# EAGLE design RP2040-mini_4L (EAGLE 9.5.2)
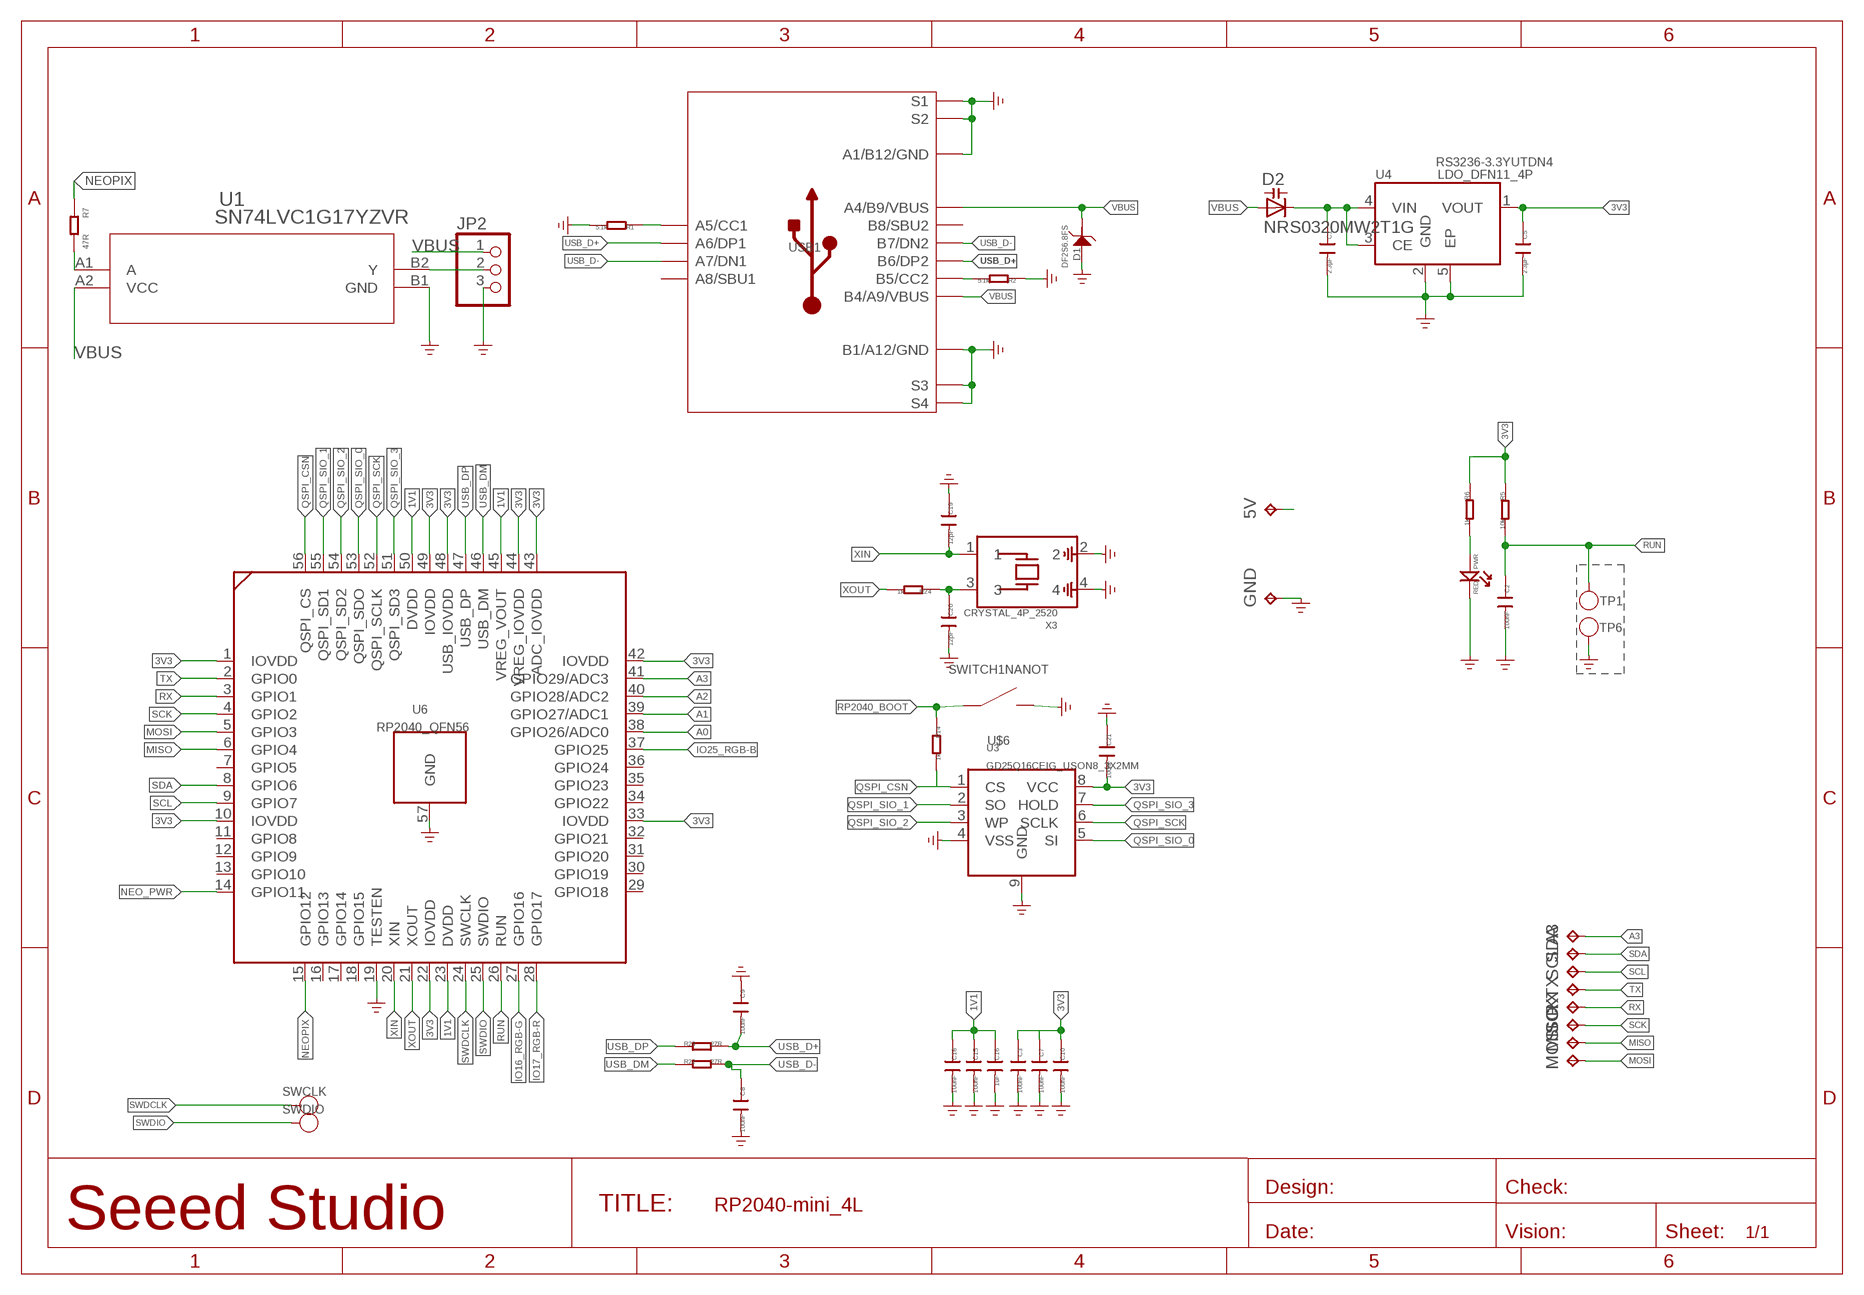
[diagram p0: schematic, sheet 1]

## Parts
5V  TPTP09R  [TP09R]
A3  TPTP07R  [TP07R]
C1  2.3µF  CAP\0201NNS  [0201_NORMAL\NOSILK]
C2  100nF  CAP\0201NNS  [0201_NORMAL\NOSILK]
C3  100nF  CAP\0201NNS  [0201_NORMAL\NOSILK]
C5  2.3µF  CAP\0201NNS  [0201_NORMAL\NOSILK]
C7  100nF  CAP\0201NNS  [0201_NORMAL\NOSILK]
C8  100nF  CAP\0201NNS  [0201_NORMAL\NOSILK]
C9  100nF  CAP\0201NNS  [0201_NORMAL\NOSILK]
C10  100nF  CAP\0201NNS  [0201_NORMAL\NOSILK]
C15  100nF  CAP\0201NNS  [0201_NORMAL\NOSILK]
C16  1uF  CAP\0201NNS  [0201_NORMAL\NOSILK]
C18  100nF  CAP\0201NNS  [0201_NORMAL\NOSILK]
C19  12pF  CAP\0201NNS  [0201_NORMAL\NOSILK]
C20  12pF  CAP\0201NNS  [0201_NORMAL\NOSILK]
C21  100nF  CAP\0201NNS  [0201_NORMAL\NOSILK]
D1  DF2S6.8FS  D-ESD-2P'DF2S6.8FS'  [SOD-923]
D2  NRS0320MW2T1G  DIODE_CAPACITANCE-SOD523  [SOD523]
GND  TPTP09R  [TP09R]
JP2  PINHD-1X3  [1X03]
MISO  TPTP07R  [TP07R]
MOSI  TPTP07R  [TP07R]
PWR  RED  LED-0402  [LED-0402]
R1  5.1k  R-0201  [R0201]
R2  5.1k  R-0201  [R0201]
R5  10k  R-0201  [R0201]
R6  1k  R-0201  [R0201]
R7  47R  RES-0201  [R0201]
R14  1k  R-0201  [R0201]
R22  27R  R-0201  [R0201]
R23  27R  R-0201  [R0201]
R24  1k  R-0201  [R0201]
RX  TPTP07R  [TP07R]
SCK  TPTP07R  [TP07R]
SCL  TPTP07R  [TP07R]
SDA  TPTP07R  [TP07R]
SWCLK  TEST-POINT-35  [TP_3535]
SWDIO  TEST-POINT-35  [TP_3535]
TP1  TEST-POINT-35  [TP_3535]
TP6  TEST-POINT-35  [TP_3535]
TX  TPTP07R  [TP07R]
U1  SN74LVC1G17YZVR  [YZV4]
U3  GD25Q16CEIG_USON8_3X2MM  [GD25Q16CEIG_USON8_3X2MM]
U4  LDO_DFN11_4P  [LDO_DFN1*1_4P]
U6  RP2040_QFN56  [RP2040_QFN56]
U$6  SWITCH1NANOT  [NANOT]
USB1  USB2.0-TYPE-C  [USB2.0-TYPE-C]
X3  CRYSTAL_4P_2520  [CRYSTAL_4P_2520]

## Nets
1V1: C15.1 C16.1 C18.1 U6.23(DVDD) U6.45(VREG_VOUT) U6.50(DVDD)
3V3: C3.1 C5.1 C7.1 C10.1 C21.2 R5.1 R6.1 U3.8(VCC) U4.1(VOUT) U6.1(IOVDD) U6.10(IOVDD) U6.22(IOVDD) U6.33(IOVDD) U6.42(IOVDD) U6.43(ADC_IOVDD) U6.44(VREG_IOVDD) U6.48(USB_IOVDD) U6.49(IOVDD)
A0: U6.38(GPIO26/ADC0)
A1: U6.39(GPIO27/ADC1)
A2: U6.40(GPIO28/ADC2)
A3: A3.TP U6.41(GPIO29/ADC3)
GND: C1.2 C2.2 C3.2 C5.2 C7.2 C8.2 C9.1 C10.2 C15.2 C16.2 C18.2 C19.1 C20.2 C21.1 D1.2 GND.TP JP2.3 PWR.- R1.2 R2.1 TP6.T U1.B1(GND) U3.4(VSS) U3.9(GND) U4.2(GND) U4.5(EP) U6.19(TESTEN) U6.57(GND) U$6.2(B) USB1.A1_B12(A1/B12/GND) USB1.B1_A12(B1/A12/GND) USB1.S1 USB1.S2 USB1.S3 USB1.S4 USB1.S5(S1) USB1.S6(S2) X3.2 X3.4 ; supply symbol labelled GND_POWER
IO16_RGB-G: U6.27(GPIO16)
IO17_RGB-R: U6.28(GPIO17)
IO25_RGB-B: U6.37(GPIO25)
MISO: MISO.TP U6.6(GPIO4)
MOSI: MOSI.TP U6.5(GPIO3)
N$1: R1.1 USB1.A5(A5/CC1)
N$2: R2.2 USB1.B5(B5/CC2)
N$4: JP2.2 U1.B2(Y)
N$7: R7.1 U1.A1(A)
N$8: C20.1 R24.1 X3.3
N$16: PWR.+ R6.2
NEO_PWR: U6.14(GPIO11)
NEOPIX: R7.2 U6.15(GPIO12)
QSPI_CSN: R14.2 U3.1(CS) U6.56(QSPI_CS)
QSPI_SCK: U3.6(SCLK) U6.52(QSPI_SCLK)
QSPI_SIO_0: U3.5(SI) U6.53(QSPI_SDO)
QSPI_SIO_1: U3.2(SO) U6.55(QSPI_SD1)
QSPI_SIO_2: U3.3(WP) U6.54(QSPI_SD2)
QSPI_SIO_3: U3.7(HOLD) U6.51(QSPI_SD3)
RP2040_BOOT: R14.1 U$6.1(A)
RUN: C2.1 R5.2 TP1.T U6.26(RUN)
RX: RX.TP U6.3(GPIO1)
SCK: SCK.TP U6.4(GPIO2)
SCL: SCL.TP U6.9(GPIO7)
SDA: SDA.TP U6.8(GPIO6)
SWDCLK: SWCLK.T U6.24(SWCLK)
SWDIO: SWDIO.T U6.25(SWDIO)
TX: TX.TP U6.2(GPIO0)
USB_D+: C9.2 R23.2 USB1.A6(A6/DP1) USB1.B6(B6/DP2)
USB_D-: C8.1 R22.2 USB1.A7(A7/DN1) USB1.B7(B7/DN2)
USB_DM: R22.1 U6.46(USB_DM)
USB_DP: R23.1 U6.47(USB_DP)
VBUS: 5V.TP D1.1 D2.A JP2.1 U1.A2(VCC) USB1.A4_B9(A4/B9/VBUS) USB1.B4_A9(B4/A9/VBUS)
VIN: C1.1 D2.C U4.3(CE) U4.4(VIN)
XIN: C19.2 U6.20(XIN) X3.1
XOUT: R24.2 U6.21(XOUT)
Unconnected: U6.7(GPIO5) U6.11(GPIO8) U6.12(GPIO9) U6.13(GPIO10) U6.16(GPIO13) U6.17(GPIO14) U6.18(GPIO15) U6.29(GPIO18) U6.30(GPIO19) U6.31(GPIO20) U6.32(GPIO21) U6.34(GPIO22) U6.35(GPIO23) U6.36(GPIO24) USB1.A8(A8/SBU1) USB1.B8(B8/SBU2)

## Notes on the sheet
- RS3236-3.3YUTDN4

## Library data of the parts
5V A3 GND MISO MOSI RX SCK SCL SDA TX = testpad:TP: Test pad
C1-C3 C5 C7-C10 C15 C16 C18-C21 = Seeed-Discrete:CAP: Ceramic Capacitors
D1 = Discrete-new:D-ESD-2P: SOD-923:304060009;SOD-123:304060001
D2 = XIAO RP2040 PRD v1.0:DIODE_CAPACITANCE-: Capacity DIODE
JP2 = Connector:PINHD-1X3: PIN HEADER; CATEGORY: CONNECTOR; SUB-CATEGORY: PIN-HEADER
PWR = Discrete-small:LED
R1 R2 R5 R6 R14 R22-R24 = XIAO RP2040 PRD v1.0:R*
R7 = Discrete-new:RES
SWCLK SWDIO TP1 TP6 = Discrete-new:TEST-POINT
U1 = thar:SN74LVC1G17YZVR; COPYRIGHT: Copyright (C) 2024 Ultra Librarian. All rights reserved.; MANUFACTURER_PART_NUMBER: SN74LVC1G17YZVR; MFR_NAME: Texas Instruments
U3 = FLASH_GD25Q16CEIG_2:GD25Q16CEIG_USON8_3X2MM
U4 = LDO_DFN1X1_4P:LDO_DFN1*1_4P
U6 = RP2040_QFN56:RP2040_QFN56
U$6 = thar:SWITCH1: OMRON ELECTRONIC COMPONENTS - A6S1104H - SCHALTER,DIP,GEHOBENER BETAETIGER,1POL Farnell Best.Nr.: 1960892 Herst.Bez.: A6S1104H
USB1 = USB C:USB2.0-TYPE-C
X3 = CRYSTAL_4P:CRYSTAL_4P_2520

## Net classes
0 default: width 0.089 mm, drill 0.2 mm, clearance 0.102 mm
1 power: width 0.152 mm, drill 0.152 mm, clearance 0.152 mm
2 gnd: width 0.152 mm, drill 0.152 mm, clearance 0.152 mm
3 usbvcc: width 0.152 mm, drill 0.152 mm, clearance 0.152 mm

## Board
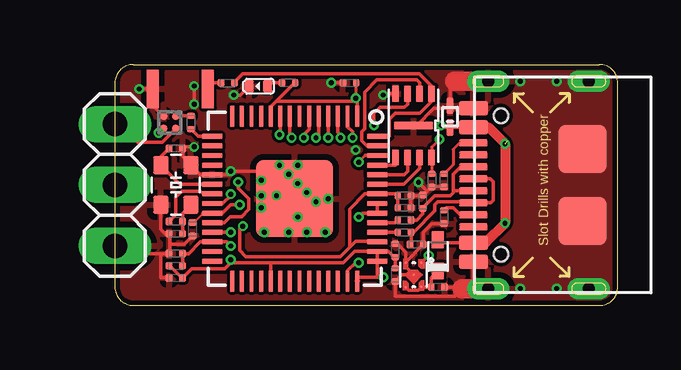
[diagram p1: board, top side]
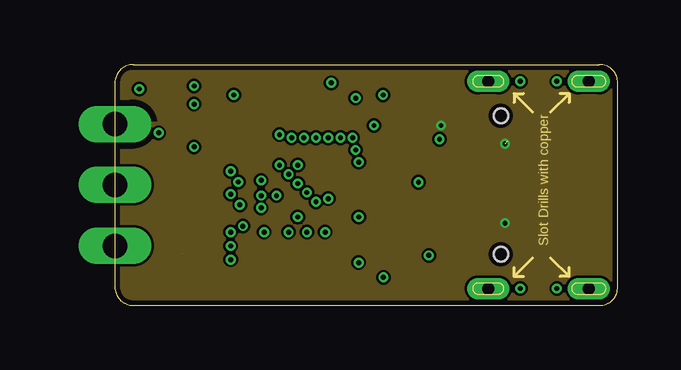
[diagram p2: board, inner layer Route2]
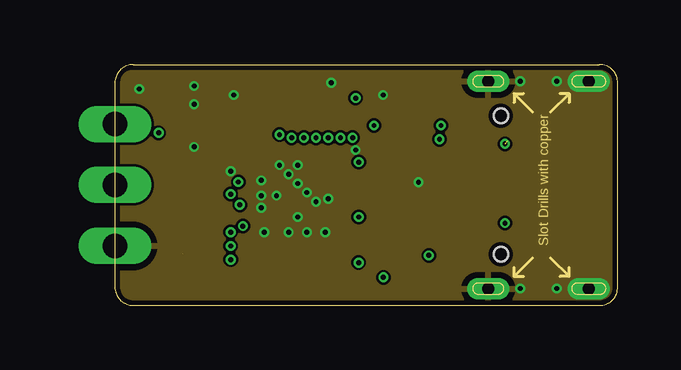
[diagram p3: board, inner layer Route15]
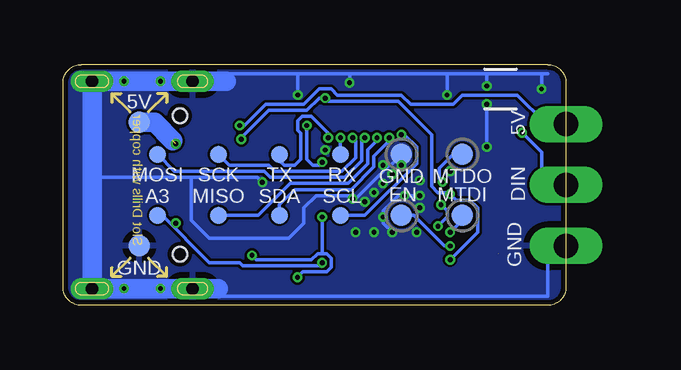
[diagram p4: board, bottom side, seen from below]

Size 20.95 x 10.03 mm. Coordinates in mm from the lower left corner, seen from the top.
Outline: 20.95,0.76 20.95,9.27 arc90 20.19,10.03 0.76,10.03 arc90 0,9.27 0,0.76 arc90 0.76,0 20.19,0 arc90 20.95,0.76
Copper layers (1*16): Top 0.035mm / dielectric 0.2mm / Bottom 0.035mm
Design rules "Seeed": minimum track width 1mil, minimum drill 0.2mm, track to track 4mil, track to pad 4mil, pad to pad 4mil, via to via 4mil, smd to smd 0mil, copper to edge 0.2mm, drill to drill 12mil, minimum pad ring 4mil, minimum via ring 4mil, stop-mask expansion 4mil, vias tented up to drill 25mil, thermal gap 10mil

### Footprints (pad centres in the part's own frame; a part is rotated, then mirrored left to right if it is on the bottom)
TP09R = smd 0.9 x 0.9: TP 0,0
TP07R = smd 0.7 x 0.7: TP 0,0
0201_NORMAL\NOSILK = smd 0.279 x 0.318: 1 -0.279,0; 2 0.279,0
SOD-923 = smd 0.7 x 0.3: 1 -0.45,0; 2 0.45,0
SOD523 = smd 0.7 x 0.5: A 0.7,0; C -0.6,0
1X03 = drill 1.016 long: 1 -2.54,0; 2 0,0; 3 2.54,0
LED-0402 = smd 0.385 x 0.508: + -0.383,0; - 0.383,0
R0201 = smd 0.279 x 0.318: 1 -0.279,0; 2 0.279,0
TP_3535 = smd 0.889 x 0.889: T 0,0
YZV4 = smd 0.305 x 0.305: A1 -0.25,0.25; A2 0.25,0.25; B1 -0.25,-0.25; B2 0.25,-0.25
GD25Q16CEIG_USON8_3X2MM = smd 0.65 x 0.3: 1 -1.33,0.75; 2 -1.33,0.25; 3 -1.33,-0.25; 4 -1.33,-0.75; 5 1.33,-0.75; 6 1.33,-0.25; 7 1.33,0.25; 8 1.33,0.75 | smd 0.3 x 1.6: 9 0,0
LDO_DFN1*1_4P = smd 0.1 x 0.1: 1 -0.33,-0.5; 2 0.33,-0.5; 3 0.33,0.51; 4 -0.33,0.5; 5 0,0
RP2040_QFN56 = smd 0.875 x 0.2: 1 -3.438,2.6; 2 -3.438,2.2; 3 -3.438,1.8; 4 -3.438,1.4; 5 -3.438,1; 6 -3.438,0.6; 7 -3.438,0.2; 8 -3.438,-0.2; 9 -3.438,-0.6; 10 -3.438,-1; 11 -3.438,-1.4; 12 -3.438,-1.8; 13 -3.438,-2.2; 14 -3.438,-2.6; 29 3.438,-2.6; 30 3.438,-2.2; 31 3.438,-1.8; 32 3.438,-1.4; 33 3.438,-1; 34 3.438,-0.6; 35 3.438,-0.2; 36 3.438,0.2; 37 3.438,0.6; 38 3.438,1; 39 3.438,1.4; 40 3.438,1.8; 41 3.438,2.2; 42 3.438,2.6 | smd 0.2 x 0.875: 15 -2.6,-3.438; 16 -2.2,-3.438; 17 -1.8,-3.438; 18 -1.4,-3.438; 19 -1,-3.438; 20 -0.6,-3.438; 21 -0.2,-3.438; 22 0.2,-3.438; 23 0.6,-3.438; 24 1,-3.438; 25 1.4,-3.438; 26 1.8,-3.438; 27 2.2,-3.438; 28 2.6,-3.438; 43 2.6,3.438; 44 2.2,3.438; 45 1.8,3.438; 46 1.4,3.438; 47 1,3.438; 48 0.6,3.438; 49 0.2,3.438; 50 -0.2,3.438; 51 -0.6,3.438; 52 -1,3.438; 53 -1.4,3.438; 54 -1.8,3.438; 55 -2.2,3.438; 56 -2.6,3.438 | smd 3.2 x 3.2: 57 0,0
NANOT = smd 0.5 x 1.6: 1 -1.15,0; 2 1.15,0
USB2.0-TYPE-C = smd 1.2 x 0.6: A1_B12 0.05,3.2; A4_B9 0.05,2.4; B1_A12 0.05,-3.2; B4_A9 0.05,-2.4 | smd 1.2 x 0.3: A5 0.05,1.25; A6 0.05,0.25; A7 0.05,-0.25; A8 0.05,-1.25; B5 0.05,-1.75; B6 0.05,-0.75; B7 0.05,0.75; B8 0.05,1.75 | drill 0.508 pad 0.889 long: S1 -4.763,4.318; S2 -4.763,-4.318; S3 -0.572,4.318; S4 -0.572,-4.318 | smd 2 x 2: S5 -4.5,1.5; S6 -4.5,-1.5 | hole 0.6: -1.1,-2.89; -1.1,2.89
CRYSTAL_4P_2520 = smd 0.75 x 0.65: 1 -0.825,-0.625; 2 0.825,-0.625; 3 0.825,0.625; 4 -0.825,0.625

### Placement (x,y rotation side)
5V  17.78,7.62 0 bottom
A3  17.02,3.75 0 bottom
C1  13.46,0.76 0 top
C2  2.54,2.16 180 top
C3  9.78,9.27 180 top
C5  2.54,1.14 180 top
C7  11.68,2.29 90 top
C8  12.57,2.54 0 top
C9  12.83,4.32 270 top
C10  11.68,1.27 270 top
C15  3.24,3.18 270 top
C16  12.06,4.06 0 top
C18  12.06,4.57 0 top
C19  2.54,6.54 180 top
C20  2.54,2.98 180 top
C21  13.21,5.21 90 top
D1  13.97,7.86 90 top
D2  13.46,2.03 90 top
GND  17.78,2.48 0 bottom
JP2  0,5.02 270 top
MISO  14.48,3.75 90 bottom
MOSI  17.02,6.29 90 bottom
PWR  5.98,9.13 180 top
R1  13.72,3.68 270 top
R2  13.72,5.21 90 top
R5  2.54,1.65 0 top
R6  7.24,9.27 180 top
R7  3.18,7.62 270 top
R14  4.7,9.27 0 top
R22  12.06,3.05 0 top
R23  12.06,3.56 0 top
R24  2.54,3.49 180 top
RX  9.4,6.29 90 bottom
SCK  14.48,6.29 90 bottom
SCL  9.4,3.75 90 bottom
SDA  11.94,3.75 0 bottom
SWCLK  4.32,6.29 0 bottom
SWDIO  4.32,3.75 0 bottom
TP1  6.86,3.75 0 bottom
TP6  6.86,6.29 0 bottom
TX  11.94,6.29 90 bottom
U1  2.29,7.62 270 top
U3  12.45,7.49 270 top
U4  12.45,1.27 180 top
U6  7.49,4.45 270 top
U$6  2.73,9.02 180 top
USB1  14.99,5.02 180 top
X3  2.54,5.02 270 top

### Tracks (layer width: path | path; a pad name or v marks a point on that pad's centre or on a via)
1V1  (via drill 0.2)
  Top 0.102: C15.1 3.3,3.45 3.64,3.79 3.64,3.82 3.67,3.85
  Top 0.127: 11.79,4.65 C18.1
  Top 0.152: C18.1 C16.1 | 11.79,4.65 U6.50 10.41,4.65 9.78,4.01 9.78,2.41 | 9.78,2.41 10.03,2.67 10.91,2.67 U6.45 | 9.78,2.41 9.4,2.03 5.46,2.03 5.21,2.29 5.21,3.18 v5.33,3.3 | 3.67,3.85 U6.23 4.48,3.85 4.83,4.19 v5.21,4.19
  Bottom 0.152: v5.33,3.3 4.95,3.68 4.95,3.94 v5.21,4.19
3V3  (via drill 0.2, 0.2 pad 0.41)
  Top 0.127: v13.53,6.92 13.2,6.59 U3.8 13.21,6.15 C21.2 | C3.1 10.03,9.12 v10.03,8.64
  Top 0.152: U6.49 U6.48 10.32,3.85 v10.16,3.68 | U6.44 U6.43 10.93,1.17 v11.19,1.17 10.09,1.17 U6.42 | C10.1 11.68,1.95 | 11.68,1.95 C7.1 | U6.1 10.09,8.64 v10.03,8.64 10.03,8.51 6.73,8.51 | 6.48,1.78 6.49,1.76 U6.33 | U6.44 11.39,2.25 11.68,1.95 | R5.1 2.29,1.65 2.79,1.14 C5.1 2.99,1.31 3.2,1.52 4.57,1.52 4.83,1.78 | 6.48,1.78 4.83,1.78 | U6.22 4.5,4.24 4.83,4.57 v4.83,4.64 | 6.48,1.78 9.52,1.78 9.99,2.25 U6.44 | R6.1 7.49,9.27 6.73,8.51 | 6.73,8.51 6.49,8.27 U6.10 | U4.1 v13.08,2.08 | v4.83,1.91 4.83,1.78
  Top 0.203: U6.42 10.11,1.02
  Bottom 0.152: v4.83,1.91 3.68,3.05 3.68,4.06 4,4.38 4.57,4.38 v4.83,4.64 4.89,4.7 5.33,4.7 5.59,4.95 5.59,7.11 6.98,8.51 9.91,8.51 v10.03,8.64 10.29,8.64 10.79,8.13 12.38,8.13 13.53,6.99 v13.53,6.92 | v10.16,3.68 10.16,2.16 | 10.16,2.16 9.97,2.16 9.78,1.97 9.78,1.59 9.97,1.4 10.96,1.4 v11.19,1.17 | v13.08,2.08 12.9,1.91 10.6,1.91 10.35,2.16 10.16,2.16
A3  (via drill 0.2)
  Top 0.152: U6.41 9.69,1.44 10.03,1.78 v10.16,1.78
  Bottom 0.152: A3.TP 16.83,3.75 14.86,1.78 13.59,1.78 13.46,1.65 10.29,1.65 v10.16,1.78
GND  (via drill 0.2, 0.2 pad 0.41)
  Top 0.152: C16.2 12.32,4.09 12.32,4.55 C18.2 12.8,4.57 C9.1 | R1.2 13.21,3.4 12.85,3.05 C8.2 12.22,1.91 12.12,1.91 | C21.1 13.18,4.95 | v11.18,8.76 11.24,8.82 U3.4 | C21.1 13.23,4.95 13.69,4.95 R2.1 | C7.2 11.76,2.57 12.12,2.21 12.12,1.91 | 12.12,1.91 U4.2 12.12,1.6 U4.5 11.96,1.27 C10.2 11.68,0.38 14.16,0.38 14.48,0.7 | X3.2 1.91,3.17 2.09,2.99 C20.2 2.29,2.96 2.29,2.54 | C2.2 2.29,2.18 2.29,2.54 | U1.B1 1.58,8.33 U$6.2 v1.02,9.02 | C21.1 13.16,4.93 C9.1 | USB1.B1_A12 14.06,8.22 | 14.06,8.22 D1.2 13.97,9.14 14.16,9.33 | U3.9 12.57,7.49 13.3,8.22 14.06,8.22 | C2.2 1.9,2.16 1.9,1.14 C5.2 | JP2.3 0.32,2.16 C2.2 | C1.2 14.86,0.76 | 14.86,0.76 14.92,0.76 14.99,0.7 | USB1.A1_B12 14.94,0.84 14.86,0.76 | C3.2 v9.02,9.27 | C15.2 3.14,2.79 2.88,2.54 2.29,2.54 | v3.3,6.6 2.88,6.6 C19.1 2.82,6.19 X3.4 3.56,5.45 U6.19 4.7,5.45 4.7,5.46 v4.83,5.59 6.86,5.59 | v3.3,8.38 v3.3,9.14 | v7.62,5.84 7.62,4.57 U6.57 6.22,4.45 v6.1,4.57 | C9.1 12.85,4.6 13.02,4.76 v12.65,5.13 | PWR.- 5.23,8.76 v4.95,8.76
  Top 0.305: U6.57 6.82,3.77 6.82,3.33
  Top 0.813: USB1.S3 14.99,0.7 14.48,0.7 | 14.16,9.33 USB1.S4
  Bottom 0.152: USB1.S4 14.41,9.33 14.1,9.65 11.18,9.65 | 11.18,9.65 9.02,9.65 | 9.02,9.65 4.95,9.65 | 4.95,9.65 3.3,9.65 | 3.3,9.65 1.02,9.65 | 1.02,9.65 0.76,9.65 | v1.02,9.02 1.02,9.65 | v9.02,9.27 9.02,9.65 | v11.18,8.76 11.18,9.65 | USB1.S3 15.24,0.38 0.76,0.38 0.76,2.41 0.7,2.48 JP2.3 | v3.3,8.38 v3.3,6.6 | v3.3,9.14 3.3,9.65 | TP6.T 7.3,5.84 7.37,5.84 | 7.37,5.84 v7.62,5.84 | v12.65,5.13 12.86,5.33 15.62,5.33 | 15.62,5.33 19.75,5.33 | v6.1,4.57 6.98,4.57 7.62,3.94 7.62,3.43 v7.24,3.05 | 7.37,5.84 8.76,4.45 v8.89,4.45 9.02,4.57 10.41,4.57 10.92,4.06 10.92,3.43 11.56,2.79 14.86,2.79 15.62,3.56 15.62,5.33 | v4.95,8.76 4.95,9.65
  Bottom 0.813: 14.16,9.33 USB1.S4 USB1.S2 19.75,5.33 USB1.S1 USB1.S3 14.48,0.7
  other vias: 6.1,5.21 6.1,4.06 6.86,5.84 8.38,4.32 8,4.7 7.24,5.46 8.76,3.05 7.62,3.68 8,3.05 6.22,3.05 6.73,4.57 7.62,5.08 10.03,6.48 16.89,9.33 18.41,9.33 18.41,0.7 16.89,0.7
  pour Top (isolate 0.127): 0,10.03 20.95,10.03 20.95,0 0,0
  pour Bottom: 0,0 0,10.03 20.95,10.03 20.95,0
  pour Route15: 0,0 0,10.03 20.95,10.03 20.95,0
IO17_RGB-R
  Top 0.152: U6.28 4.06,1.84
MISO  (via drill 0.2)
  Top 0.152: U6.6 8.09,7.33 7.87,7.11 v7.87,6.99
  Bottom 0.152: MISO.TP 12.83,3.75 11.49,5.08 9.08,5.08 8.25,5.91 8.25,6.48 7.87,6.86 v7.87,6.99
MOSI  (via drill 0.2)
  Top 0.152: U6.5 8.49,7.1 v8.38,6.99
  Bottom 0.152: MOSI.TP 16.32,5.59 12.57,5.59 12.32,5.33 9.21,5.33 8.51,6.03 8.51,6.86 v8.38,6.99
N$1
  Top 0.152: USB1.A5 14.39,3.77 14.1,4.06 13.82,4.06 R1.1
N$2
  Top 0.127: USB1.B5 14.9,6.73 14.33,6.73 14.1,6.5 14.1,5.87 R2.2
N$4  (via drill 0.2)
  Top 0.152: U1.B2 2.01,7.37 v1.83,7.19
  Bottom 0.152: v1.83,7.19 1.02,6.38 1.02,5.02 JP2.2
N$7
  Top 0.152: U1.A1 2.56,7.9 R7.1
N$8
  Top 0.152: C20.1 R24.1 2.82,3.85 X3.3
N$16
  Top 0.152: R6.2 6.5,9.27 PWR.+
NEOPIX
  Top 0.152: U6.15 3.47,7.04 R7.2
QSPI_CSN
  Top 0.152: U6.56 11.44,7.04 11.44,7.76 11.68,8 12.7,8 13.2,8.5 U3.1 13.2,9.13 12.68,9.65 5.33,9.65 4.98,9.3 R14.2
QSPI_SCK
  Top 0.152: U3.6 12.2,5.59 12.05,5.45 U6.52
QSPI_SIO_0
  Top 0.152: U6.53 11.69,5.85 11.7,5.85 U3.5
QSPI_SIO_1
  Top 0.127: U3.2 12.66,8.79
  Top 0.152: U3.2 12.7,9.28 12.57,9.4 10.92,9.4 10.41,8.89 10.41,7.37 10.29,7.24 10.29,6.86 10.5,6.65 U6.55
QSPI_SIO_2  (via drill 0.2 pad 0.41)
  Top 0.127: v10.16,5.97 10.44,6.24
  Top 0.152: v10.79,7.49 10.79,8 11.05,8.26 12.06,8.26 12.2,8.39 U3.3 | 10.44,6.24 U6.54
  Bottom 0.152: v10.79,7.49 10.79,6.1 10.54,5.84 10.29,5.84 v10.16,5.97
QSPI_SIO_3
  Top 0.152: U6.51 12.03,5.04 12.7,5.71 U3.7
RP2040_BOOT
  Top 0.152: R14.1 4.13,9.27 U$6.1
RUN  (via drill 0.2)  (1 unrouted)
  Top 0.152: U6.26 | R5.2 C2.1 3.07,2.16 3.56,2.65 U6.26 | U6.26 4.66,2.65 v4.83,2.48
  Bottom 0.152: v4.83,2.48 5.08,2.48 6.35,3.75 TP1.T
RX  (via drill 0.2)
  Top 0.152: U6.3 9.29,7.22 9.4,7.11 v9.4,6.99
  Bottom 0.152: v9.4,6.99 RX.TP
SCK  (via drill 0.2)
  Top 0.152: U6.4 v8.89,6.99
  Bottom 0.152: v8.89,6.99 8.76,6.86 8.76,6.16 9.33,5.59 12.13,5.59 12.38,5.84 14.03,5.84 SCK.TP
SCL  (via drill 0.2)
  Top 0.152: U6.9 6.89,7.15 v6.86,7.11
  Bottom 0.152: v6.86,7.11 6.73,7.11 6.22,6.6 6.22,5.91 8.38,3.75 SCL.TP
SDA  (via drill 0.2)
  Top 0.152: U6.8 7.29,7.06 v7.37,6.99
  Bottom 0.152: v7.37,6.99 7.37,6.86 8,6.22 8,5.78 8.95,4.83 11.3,4.83 11.94,4.19 SDA.TP
SWDCLK  (via drill 0.2)
  Top 0.152: U6.24 4.56,3.45 4.82,3.7 5.29,3.7 5.59,4 5.59,4.45 5.14,4.89 v5.14,5.14
  Bottom 0.152: SWCLK.T 4.7,6.29 5.27,5.72 5.27,5.27 v5.14,5.14
SWDIO  (via drill 0.2)
  Top 0.152: v4.83,3.05 4.64,3.05 4.63,3.04 U6.25
  Bottom 0.152: v4.83,3.05 4.32,3.56 SWDIO.T
TX  (via drill 0.2)
  Top 0.152: U6.2 9.69,7.45 9.91,7.24 v9.91,6.99
  Bottom 0.152: TX.TP 11.94,6.03 11.75,5.84 11.3,5.84 11.05,6.1 11.05,7.18 11.18,7.3 11.18,7.68 10.98,7.87 10.61,7.87 9.91,7.18 v9.91,6.99
USB_D+
  Top 0.102: USB1.A6
  Top 0.152: USB1.B6 14.4,5.77 14.1,5.46 14.1,4.7 | R23.2 12.57,3.56 12.83,3.81 C9.2 12.83,4.06 13.34,4.57 13.97,4.57 14.1,4.7 | USB1.A6 14.16,4.77 14.1,4.7
USB_D-
  Top 0.152: USB1.A7 15.65,5.27 15.77,5.14 15.77,4.38 15.66,4.27 USB1.B7 14.43,4.27 14.38,4.32 13.46,4.32 13.34,4.19 13.34,3.94 12.45,3.05 R22.2 12.34,2.59 C8.1
USB_DM
  Top 0.152: U6.46 R22.1
USB_DP
  Top 0.152: U6.47 11.68,3.45 R23.1
VBUS  (via drill 0.2, 0.2 pad 0.41)  (1 unrouted)
  Top 0.127: 14.53,7.42 USB1.B4_A9
  Top 0.152: U1.A2 1.97,6.79 0.95,6.79 0.19,7.56 JP2.1 | USB1.B4_A9 D1.1 13.67,7.41 v13.59,7.49 | USB1.A4_B9 13.58,2.62 D2.A
  Top 0.406: USB1.B4_A9 15.57,7.42 v16.26,6.73 v16.26,3.43 15.46,2.63 14.95,2.63 USB1.A4_B9
  Bottom 0.152: v13.59,7.49 13.4,7.49 12.51,8.38 10.92,8.38 10.29,9.02 9.78,9.02 9.52,8.76 6.86,8.76 6.48,8.38 4.7,8.38 4.32,8.76 2.03,8.76 0.89,7.62 0.06,7.62 JP2.1
  Bottom 0.813: 5V.TP 17.13,7.62 16.38,6.86
  pour Route2: 0,0 0,10.03 20.95,10.03 20.95,0
VIN
  Top 0.152: 13.13,0.81 C1.1 | U4.3 12.24,0.63 12.64,0.63 U4.4 12.78,0.76 C1.1 | C1.1 13.18,1.15 D2.C
XIN
  Top 0.152: C19.2 1.91,6.2 X3.1 2.71,5.04 U6.20
XOUT
  Top 0.152: R24.2 2.54,3.77 2.54,4.51 2.79,4.76 3.56,4.76 3.67,4.65 U6.21

### Text on the board
bNames: 5V | DIN | MTDI | MTDO | EN | GND | GND